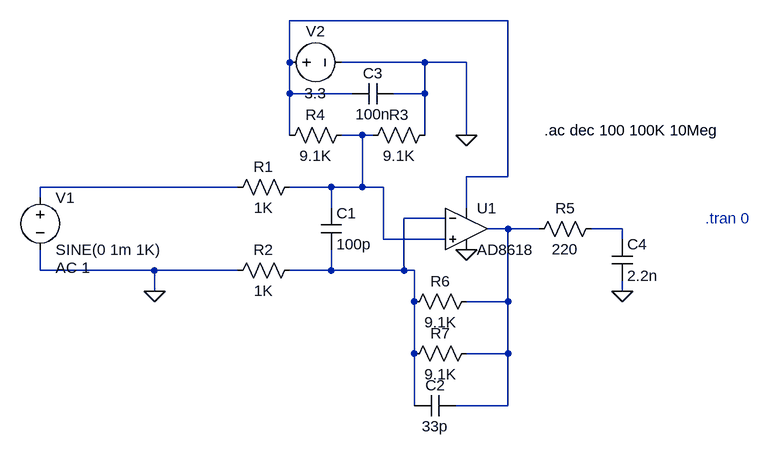
[diagram p0: schematic DraftOP.asc]
DraftOP.asc, the LTspice schematic file:
Version 4.1
SHEET 1 1076 680
WIRE 656 -160 320 -160
WIRE 320 -96 320 -160
WIRE 528 -96 400 -96
WIRE 592 -96 528 -96
WIRE 320 -48 320 -96
WIRE 416 -48 320 -48
WIRE 528 -48 528 -96
WIRE 528 -48 480 -48
WIRE 320 16 320 -48
WIRE 432 16 400 16
WIRE 448 16 432 16
WIRE 528 16 528 -48
WIRE 592 16 592 -96
WIRE 656 80 656 -160
WIRE 656 80 592 80
WIRE 240 96 -64 96
WIRE 384 96 320 96
WIRE 432 96 432 16
WIRE 432 96 384 96
WIRE 464 96 432 96
WIRE -64 112 -64 96
WIRE 384 128 384 96
WIRE 592 128 592 80
WIRE 560 144 496 144
WIRE 656 160 624 160
WIRE 704 160 656 160
WIRE 832 160 784 160
WIRE 464 176 464 96
WIRE 560 176 464 176
WIRE 832 176 832 160
WIRE -64 224 -64 192
WIRE 112 224 -64 224
WIRE 240 224 112 224
WIRE 384 224 384 192
WIRE 384 224 320 224
WIRE 496 224 496 144
WIRE 496 224 384 224
WIRE 512 224 496 224
WIRE 112 256 112 224
WIRE 832 256 832 240
WIRE 512 272 512 224
WIRE 656 272 656 160
WIRE 656 272 592 272
WIRE 512 352 512 272
WIRE 656 352 656 272
WIRE 656 352 592 352
WIRE 512 432 512 352
WIRE 656 432 656 352
WIRE 656 432 576 432
FLAG 592 16 0
FLAG 112 256 0
FLAG 592 192 0
FLAG 832 256 0
SYMBOL res 336 80 R90
WINDOW 0 0 56 VBottom 2
WINDOW 3 32 56 VTop 2
SYMATTR InstName R1
SYMATTR Value 1K
SYMBOL res 336 208 R90
WINDOW 0 0 56 VBottom 2
WINDOW 3 32 56 VTop 2
SYMATTR InstName R2
SYMATTR Value 1K
SYMBOL res 544 0 R90
WINDOW 0 0 56 VBottom 2
WINDOW 3 32 56 VTop 2
SYMATTR InstName R3
SYMATTR Value 9.1K
SYMBOL res 416 0 R90
WINDOW 0 0 56 VBottom 2
WINDOW 3 32 56 VTop 2
SYMATTR InstName R4
SYMATTR Value 9.1K
SYMBOL voltage 304 -96 R270
WINDOW 0 32 56 VTop 2
WINDOW 3 -32 56 VBottom 2
WINDOW 123 0 0 Left 0
WINDOW 39 0 0 Left 0
SYMATTR InstName V2
SYMATTR Value 3.3
SYMBOL cap 368 128 R0
SYMATTR InstName C1
SYMATTR Value 100p
SYMBOL res 608 256 R90
WINDOW 0 0 56 VBottom 2
WINDOW 3 32 56 VTop 2
SYMATTR InstName R6
SYMATTR Value 9.1K
SYMBOL res 608 336 R90
WINDOW 0 0 56 VBottom 2
WINDOW 3 32 56 VTop 2
SYMATTR InstName R7
SYMATTR Value 9.1K
SYMBOL cap 576 416 R90
WINDOW 0 0 32 VBottom 2
WINDOW 3 32 32 VTop 2
SYMATTR InstName C2
SYMATTR Value 33p
SYMBOL cap 480 -64 R90
WINDOW 0 0 32 VBottom 2
WINDOW 3 32 32 VTop 2
SYMATTR InstName C3
SYMATTR Value 100n
SYMBOL voltage -64 96 R0
WINDOW 123 24 124 Left 2
WINDOW 39 0 0 Left 0
SYMATTR Value2 AC 1
SYMATTR InstName V1
SYMATTR Value SINE(0 1m 1K)
SYMBOL res 800 144 R90
WINDOW 0 0 56 VBottom 2
WINDOW 3 32 56 VTop 2
SYMATTR InstName R5
SYMATTR Value 220
SYMBOL cap 816 176 R0
SYMATTR InstName C4
SYMATTR Value 2.2n
SYMBOL OpAmps\\AD8618 592 160 R0
SYMATTR InstName U1
TEXT 712 8 Left 2 !.ac dec 100 100K 10Meg
TEXT 960 144 Left 2 ;.tran 0

The netlist it stands for:
* DraftOP.asc
R1 N002 N003 1K
R2 N004 0 1K
R3 0 N002 9.1K
R4 N002 N001 9.1K
V2 N001 0 3.3
C1 N002 N004 100p
R6 N005 N004 9.1K
R7 N005 N004 9.1K
C2 N005 N004 33p
C3 0 N001 100n
V1 N003 0 SINE(0 1m 1K) AC 1
R5 N006 N005 220
C4 N006 0 2.2n
* U1: AD8618 (symbol OpAmps\AD8618 not available, pins judged from their places): In+=N002 In-=N004 V+=N001 V-=0 OUT=N005
.ac dec 100 100K 10Meg
* .tran 0
.backanno
.end